# Altium schematic sheet SensorBoard.SchDoc
size A2
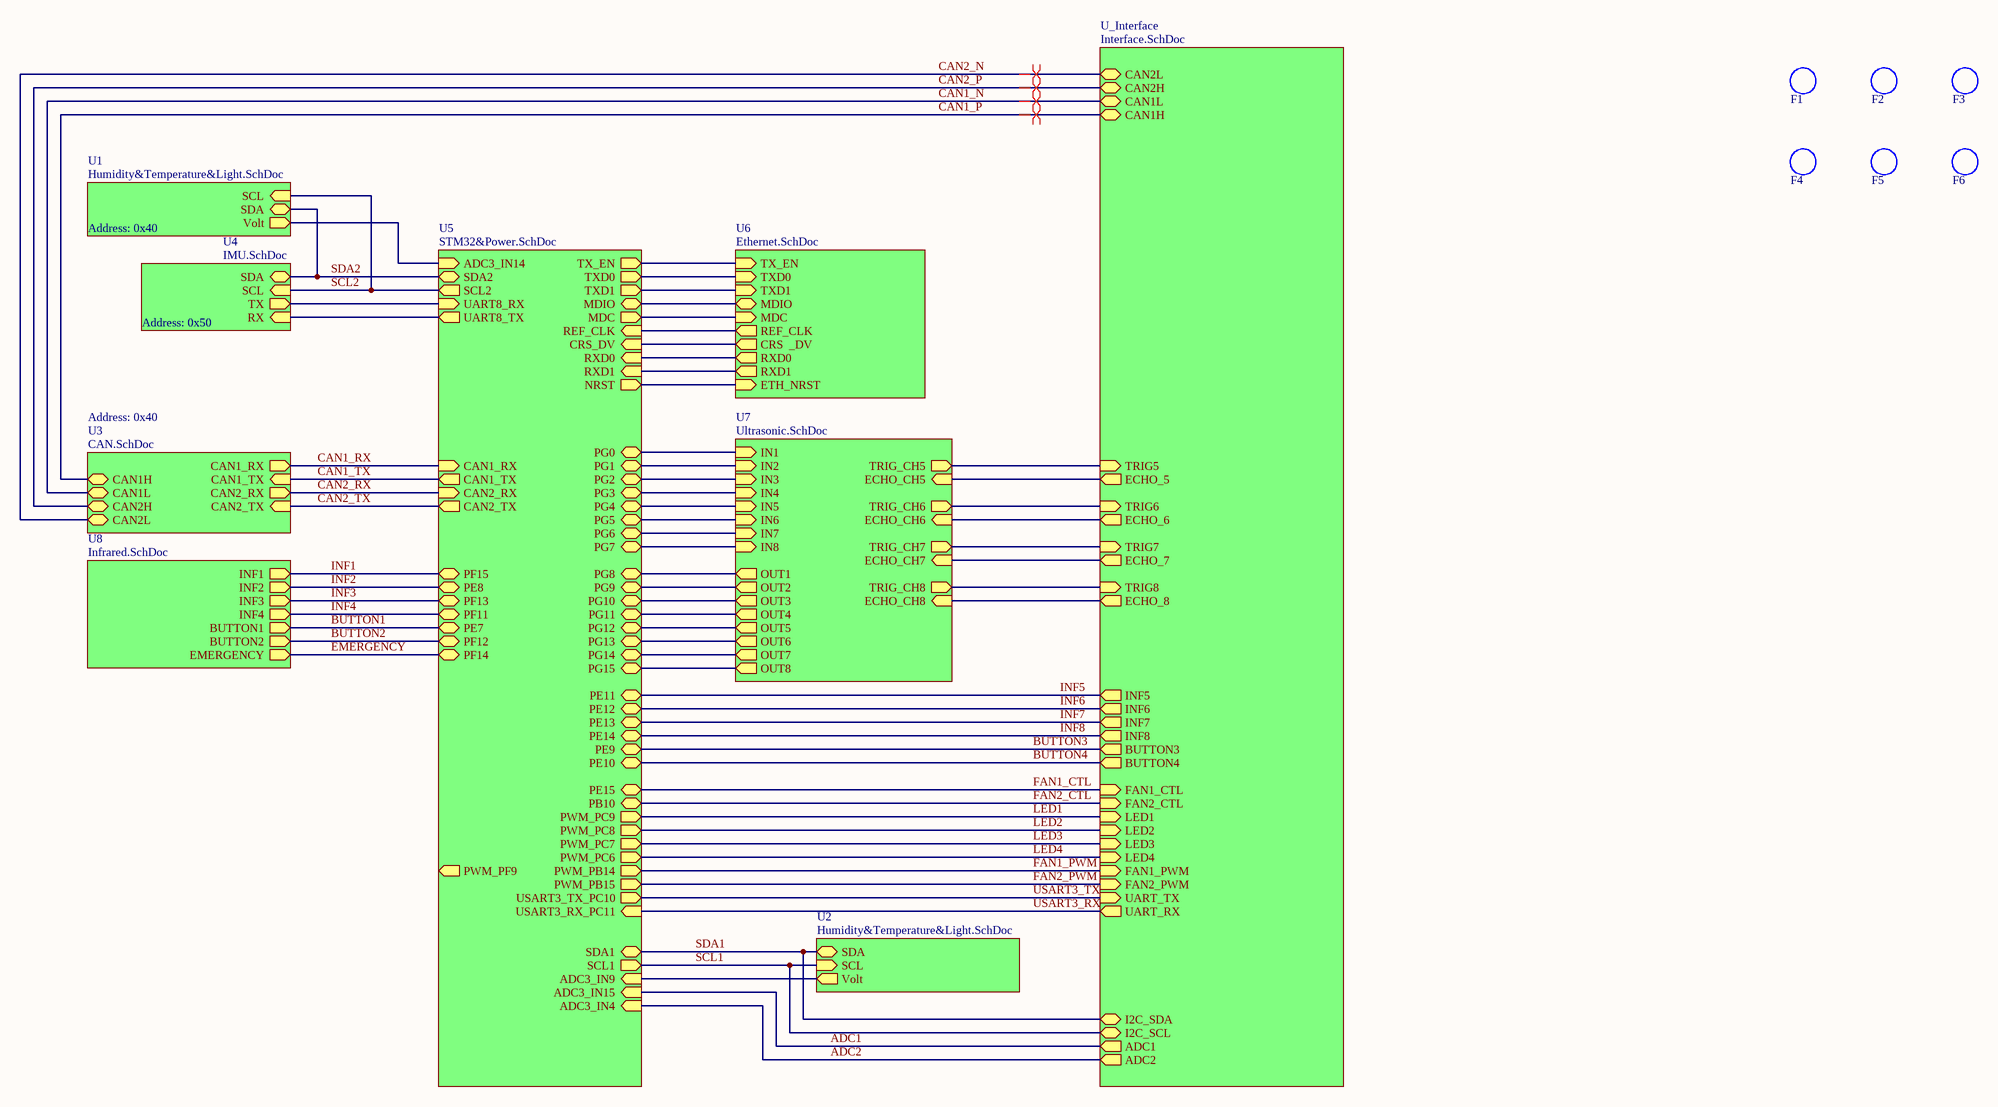
[diagram p0: SensorBoard.SchDoc]

## Parts
F1  Fiducial, .040"  [FIDUCIAL, .040"]  (value not drawn)  (no BOM)
F2  Fiducial, .040"  [FIDUCIAL, .040"]  (value not drawn)  (no BOM)
F3  Fiducial, .040"  [FIDUCIAL, .040"]  (value not drawn)  (no BOM)
F4  Fiducial, .040"  [FIDUCIAL, .040"]  (value not drawn)  (no BOM)
F5  Fiducial, .040"  [FIDUCIAL, .040"]  (value not drawn)  (no BOM)
F6  Fiducial, .040"  [FIDUCIAL, .040"]  (value not drawn)  (no BOM)

## Sub-sheets
U1 = Humidity&Temperature&Light.SchDoc: SDA (bidir), SCL (in), Volt (out)
U2 = Humidity&Temperature&Light.SchDoc: SDA (bidir), SCL (in), Volt (out)
U3 = CAN.SchDoc: CAN1_TX (in), CAN1_RX (out), CAN2_TX (in), CAN2_RX (out), CAN1H (bidir), CAN2H (bidir), CAN1L (bidir), CAN2L (bidir)
U4 = IMU.SchDoc: RX (in), TX (out), SDA (bidir), SCL (in)
U5 = STM32&Power.SchDoc: SDA1 (bidir), SCL1 (out), MDC (out), REF_CLK (in), MDIO (bidir), CRS_DV (in), TX_EN (out), TXD0 (out), TXD1 (out), RXD0 (in), RXD1 (in), UART8_RX (in), UART8_TX (out), SDA2 (bidir), SCL2 (out), ADC3_IN14 (in), ADC3_IN15 (in), ADC3_IN9 (in), CAN2_TX (out), CAN2_RX (in), CAN1_TX (out), CAN1_RX (in), PG0 (bidir), PG1 (bidir), PG2 (bidir), PG3 (bidir), PG4 (bidir), PG5 (bidir), PG6 (bidir), PG7 (bidir), PG15 (bidir), PG10 (bidir), PG13 (bidir), PG9 (bidir), PG8 (bidir), PG12 (bidir), PG14 (bidir), PG11 (bidir), PF13 (bidir), PF12 (bidir), PF15 (bidir), PF14 (bidir), PF11 (bidir), PE14 (bidir), PE13 (bidir), PE10 (bidir), PE7 (bidir), PE15 (bidir), PE9 (bidir), PE12 (bidir), PE8 (bidir), PE11 (bidir), PB10 (bidir), PWM_PC6 (out), PWM_PF9 (out), PWM_PC9 (out), PWM_PC8 (out), PWM_PC7 (out), ADC3_IN4 (in), USART3_RX_PC11 (in), USART3_TX_PC10 (out), NRST (out), PWM_PB14 (out), PWM_PB15 (out)
U6 = Ethernet.SchDoc: TX_EN (in), RXD1 (out), TXD0 (in), TXD1 (in), RXD0 (out), CRS  _DV (out), MDIO (bidir), MDC (in), REF_CLK (out), ETH_NRST (in)
U7 = Ultrasonic.SchDoc: OUT1 (out), OUT2 (out), OUT3 (out), OUT4 (out), OUT5 (out), OUT6 (out), OUT7 (out), OUT8 (out), IN1 (in), IN2 (in), IN3 (in), IN4 (in), IN5 (in), IN6 (in), IN7 (in), IN8 (in), ECHO_CH5 (in), ECHO_CH6 (in), ECHO_CH7 (in), ECHO_CH8 (in), TRIG_CH5 (out), TRIG_CH6 (out), TRIG_CH7 (out), TRIG_CH8 (out)
U8 = Infrared.SchDoc: INF1 (out), INF2 (out), INF3 (out), INF4 (out), BUTTON1 (out), BUTTON2 (out), EMERGENCY (out)
U_Interface = Interface.SchDoc: CAN1H (bidir), CAN1L (bidir), CAN2H (bidir), CAN2L (bidir), ECHO_5 (out), ECHO_6 (out), ECHO_7 (out), ECHO_8 (out), TRIG5 (in), TRIG6 (in), TRIG7 (in), TRIG8 (in), BUTTON3 (out), BUTTON4 (out), INF5 (out), INF6 (out), INF7 (out), INF8 (out), I2C_SCL (bidir), I2C_SDA (bidir), LED1 (in), LED2 (in), LED3 (in), LED4 (in), ADC1 (out), ADC2 (out), UART_TX (in), UART_RX (out), FAN1_CTL (in), FAN2_CTL (in), FAN1_PWM (in), FAN2_PWM (in)

## Nets
ADC1: sheet U5/ADC3_IN15, sheet U_Interface/ADC1
ADC2: sheet U5/ADC3_IN4, sheet U_Interface/ADC2
BUTTON1: sheet U5/PE7, sheet U8/BUTTON1
BUTTON2: sheet U5/PF12, sheet U8/BUTTON2
BUTTON3: sheet U5/PE9, sheet U_Interface/BUTTON3
BUTTON4: sheet U5/PE10, sheet U_Interface/BUTTON4
CAN1_N: sheet U3/CAN1L, sheet U_Interface/CAN1L
CAN1_P: sheet U3/CAN1H, sheet U_Interface/CAN1H
CAN1_RX: sheet U5/CAN1_RX, sheet U3/CAN1_RX
CAN1_TX: sheet U5/CAN1_TX, sheet U3/CAN1_TX
CAN2_N: sheet U3/CAN2L, sheet U_Interface/CAN2L
CAN2_P: sheet U3/CAN2H, sheet U_Interface/CAN2H
CAN2_RX: sheet U5/CAN2_RX, sheet U3/CAN2_RX
CAN2_TX: sheet U5/CAN2_TX, sheet U3/CAN2_TX
EMERGENCY: sheet U5/PF14, sheet U8/EMERGENCY
FAN1_CTL: sheet U5/PE15, sheet U_Interface/FAN1_CTL
FAN1_PWM: sheet U5/PWM_PB14, sheet U_Interface/FAN1_PWM
FAN2_CTL: sheet U5/PB10, sheet U_Interface/FAN2_CTL
FAN2_PWM: sheet U5/PWM_PB15, sheet U_Interface/FAN2_PWM
INF1: sheet U5/PF15, sheet U8/INF1
INF2: sheet U5/PE8, sheet U8/INF2
INF3: sheet U5/PF13, sheet U8/INF3
INF4: sheet U5/PF11, sheet U8/INF4
INF5: sheet U5/PE11, sheet U_Interface/INF5
INF6: sheet U5/PE12, sheet U_Interface/INF6
INF7: sheet U5/PE13, sheet U_Interface/INF7
INF8: sheet U5/PE14, sheet U_Interface/INF8
LED1: sheet U5/PWM_PC9, sheet U_Interface/LED1
LED2: sheet U5/PWM_PC8, sheet U_Interface/LED2
LED3: sheet U5/PWM_PC7, sheet U_Interface/LED3
LED4: sheet U5/PWM_PC6, sheet U_Interface/LED4
SCL1: sheet U5/SCL1, sheet U2/SCL, sheet U_Interface/I2C_SCL
SCL2: sheet U5/SCL2, sheet U4/SCL, sheet U1/SCL
SDA1: sheet U5/SDA1, sheet U2/SDA, sheet U_Interface/I2C_SDA
SDA2: sheet U5/SDA2, sheet U4/SDA, sheet U1/SDA
USART3_RX: sheet U5/USART3_RX_PC11, sheet U_Interface/UART_RX
USART3_TX: sheet U5/USART3_TX_PC10, sheet U_Interface/UART_TX
(unnamed): sheet U6/TX_EN, sheet U5/TX_EN
(unnamed): sheet U6/RXD1, sheet U5/RXD1
(unnamed): sheet U6/TXD0, sheet U5/TXD0
(unnamed): sheet U6/TXD1, sheet U5/TXD1
(unnamed): sheet U6/RXD0, sheet U5/RXD0
(unnamed): sheet U6/CRS  _DV, sheet U5/CRS_DV
(unnamed): sheet U6/MDIO, sheet U5/MDIO
(unnamed): sheet U6/MDC, sheet U5/MDC
(unnamed): sheet U6/REF_CLK, sheet U5/REF_CLK
(unnamed): sheet U6/ETH_NRST, sheet U5/NRST
(unnamed): sheet U5/UART8_RX, sheet U4/TX
(unnamed): sheet U5/UART8_TX, sheet U4/RX
(unnamed): sheet U5/ADC3_IN14, sheet U1/Volt
(unnamed): sheet U5/ADC3_IN9, sheet U2/Volt
(unnamed): sheet U5/PG0, sheet U7/IN1
(unnamed): sheet U5/PG1, sheet U7/IN2
(unnamed): sheet U5/PG2, sheet U7/IN3
(unnamed): sheet U5/PG3, sheet U7/IN4
(unnamed): sheet U5/PG4, sheet U7/IN5
(unnamed): sheet U5/PG5, sheet U7/IN6
(unnamed): sheet U5/PG6, sheet U7/IN7
(unnamed): sheet U5/PG7, sheet U7/IN8
(unnamed): sheet U5/PG15, sheet U7/OUT8
(unnamed): sheet U5/PG10, sheet U7/OUT3
(unnamed): sheet U5/PG13, sheet U7/OUT6
(unnamed): sheet U5/PG9, sheet U7/OUT2
(unnamed): sheet U5/PG8, sheet U7/OUT1
(unnamed): sheet U5/PG12, sheet U7/OUT5
(unnamed): sheet U5/PG14, sheet U7/OUT7
(unnamed): sheet U5/PG11, sheet U7/OUT4
(unnamed): sheet U7/ECHO_CH5, sheet U_Interface/ECHO_5
(unnamed): sheet U7/ECHO_CH6, sheet U_Interface/ECHO_6
(unnamed): sheet U7/ECHO_CH7, sheet U_Interface/ECHO_7
(unnamed): sheet U7/ECHO_CH8, sheet U_Interface/ECHO_8
(unnamed): sheet U7/TRIG_CH5, sheet U_Interface/TRIG5
(unnamed): sheet U7/TRIG_CH6, sheet U_Interface/TRIG6
(unnamed): sheet U7/TRIG_CH7, sheet U_Interface/TRIG7
(unnamed): sheet U7/TRIG_CH8, sheet U_Interface/TRIG8

## Layout directives
differential pair: CAN1_N, CAN1_P, CAN2_N, CAN2_P

## Notes on the sheet
- Address: 0x40
- Address: 0x50

## Library data of the parts
F1-F6 = Fiducial, .040": Designator: F?; Part Number: Fiducial, .040"; Component Type: Standard (No BOM)